# Altium schematic sheet lpf-swr-srtucture.SchDoc
size A4; SheetNumber: 1; SheetTotal: 4
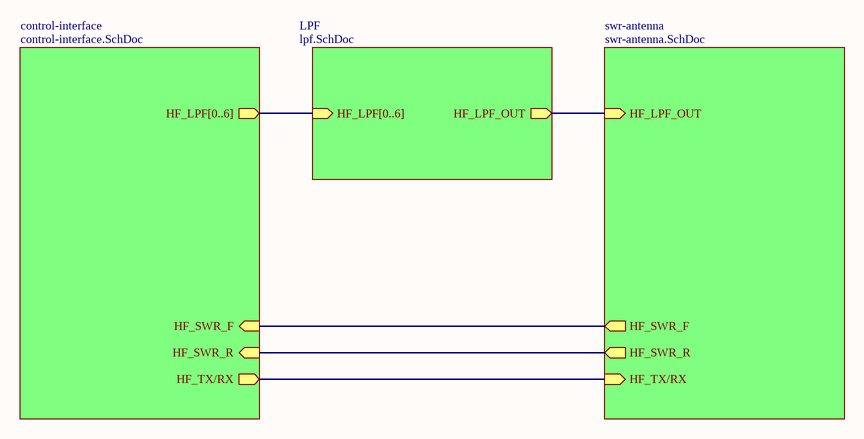
[diagram p0: lpf-swr-srtucture.SchDoc]

## Sub-sheets
control-interface = control-interface.SchDoc: HF_LPF[0..6] (out), HF_SWR_F (in), HF_SWR_R (in), HF_TX/RX (out)
LPF = lpf.SchDoc: HF_LPF_OUT (out), HF_LPF[0..6] (in)
swr-antenna = swr-antenna.SchDoc: HF_LPF_OUT (in), HF_SWR_F (out), HF_SWR_R (out), HF_TX/RX (in)

## Nets
(unnamed): sheet control-interface/HF_SWR_F, sheet swr-antenna/HF_SWR_F
(unnamed): sheet control-interface/HF_SWR_R, sheet swr-antenna/HF_SWR_R
(unnamed): sheet control-interface/HF_TX/RX, sheet swr-antenna/HF_TX/RX
(unnamed): sheet LPF/HF_LPF_OUT, sheet swr-antenna/HF_LPF_OUT

## Buses and harness runs
bus sheet control-interface/HF_LPF[0..6] = sheet LPF/HF_LPF[0..6]